# EAGLE design micro_mirror1 (EAGLE 8.6.3)
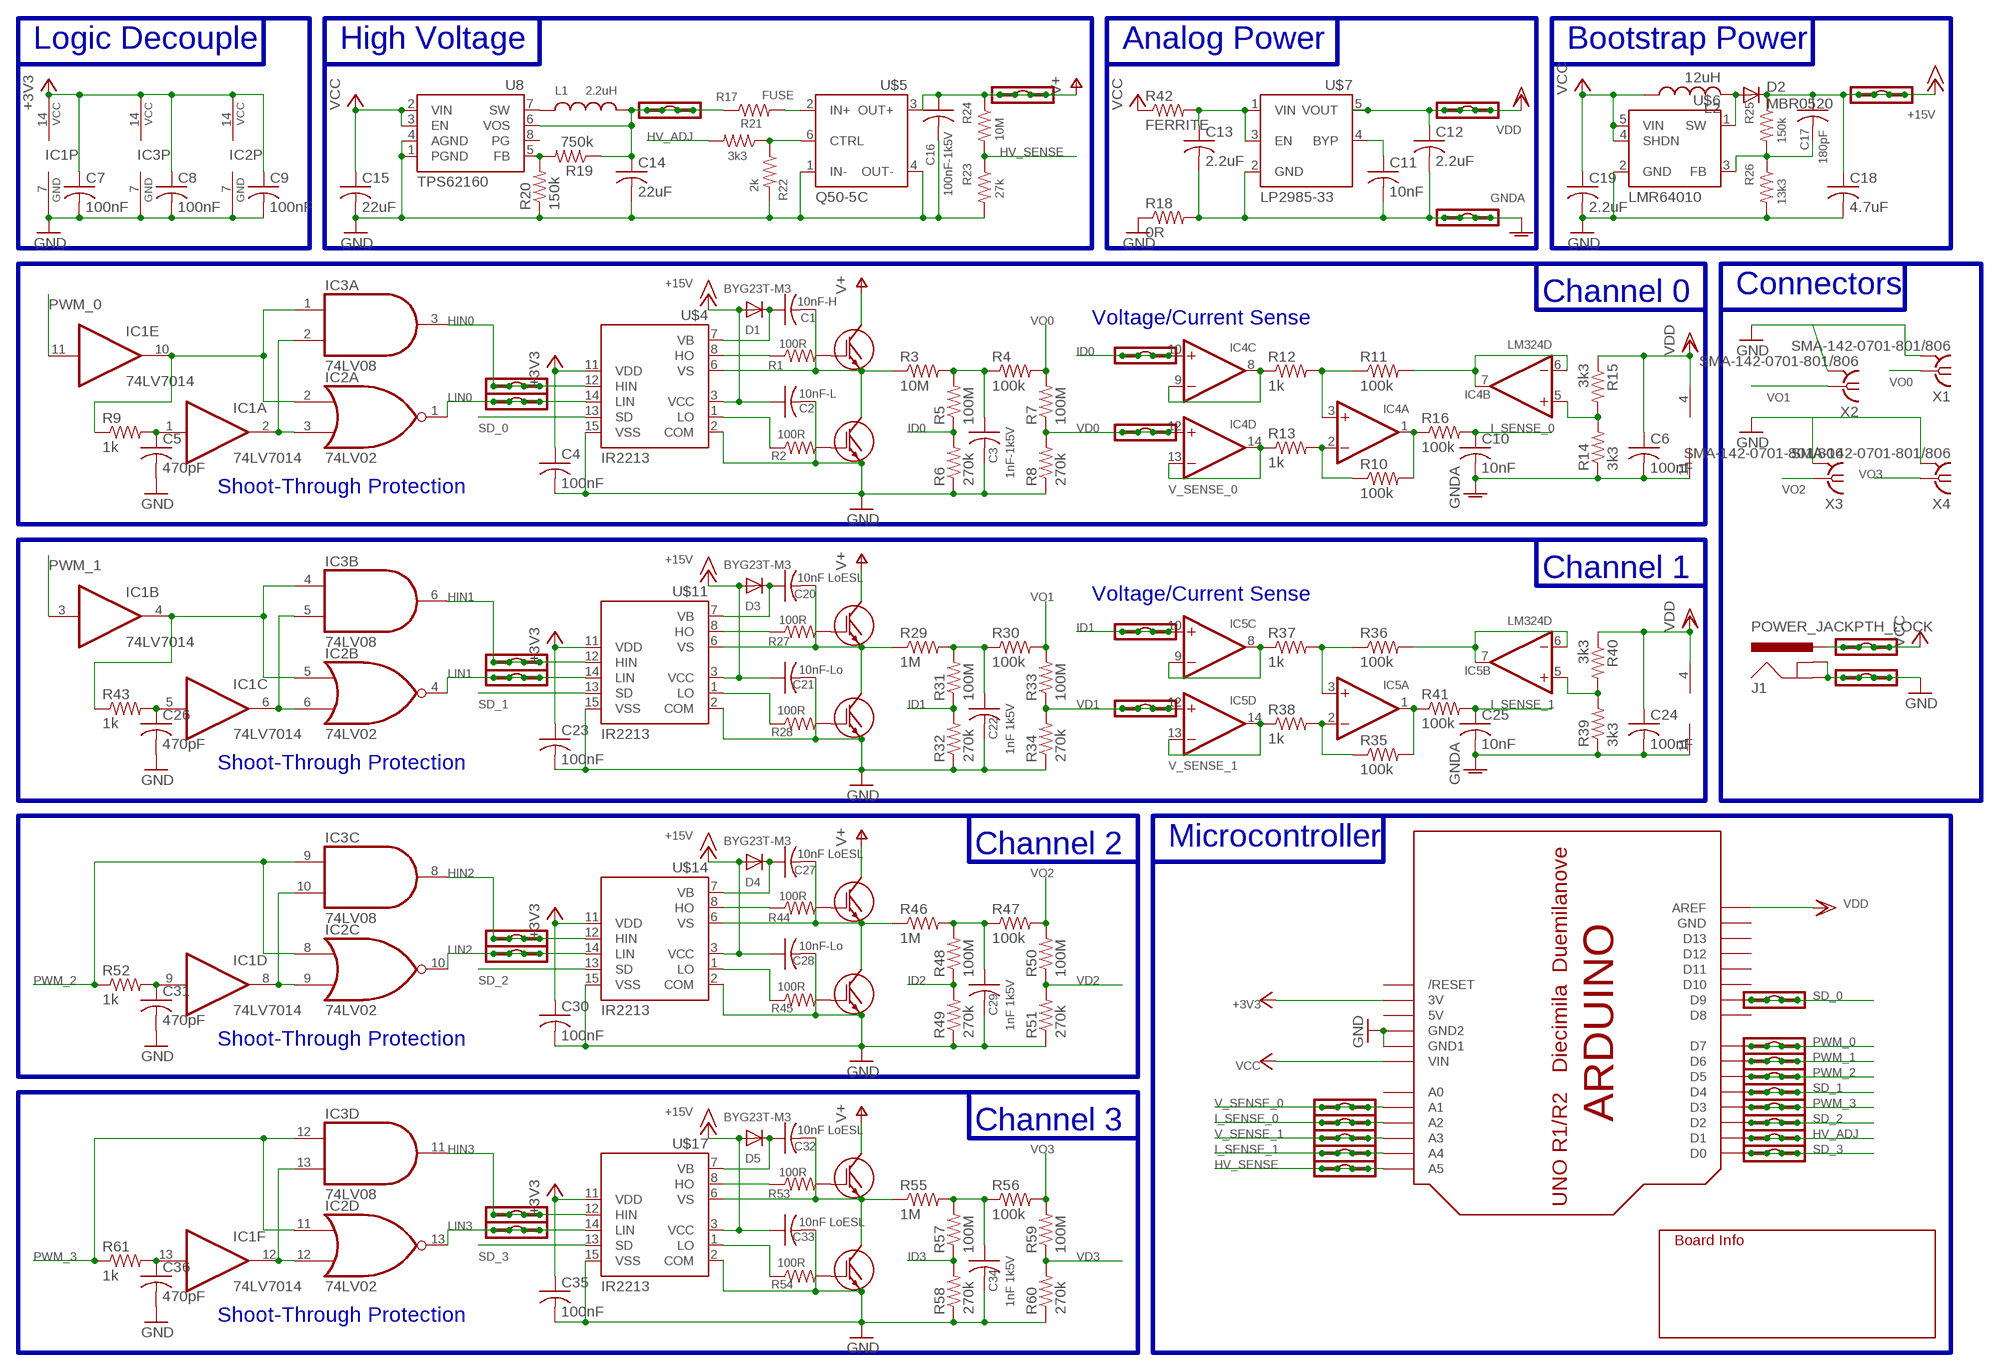
[diagram p0: schematic, sheet 1]

## Parts
15V_OUT  M04LOCK  [1X04_LOCK]
C1  10nF-H  C-USC1206  [C1206]
C2  10nF-L  C-USC1206  [C1206]
C3  1nF-1k5V  C-USC1206  [C1206]
C4  100nF  C-USC1206  [C1206]
C5  470pF  C-USC1206  [C1206]
C6  100nF  C-USC1206  [C1206]
C7  100nF  C-USC1206  [C1206]
C8  100nF  C-USC1206  [C1206]
C9  100nF  C-USC1206  [C1206]
C10  10nF  C-USC1206  [C1206]
C11  10nF  C-USC1206  [C1206]
C12  2.2uF  C-USC1206  [C1206]
C13  2.2uF  C-USC1206  [C1206]
C14  22uF  C-USC1206  [C1206]
C15  22uF  C-USC1206  [C1206]
C16  100nF-1k5V  C-USC2225K  [C2225K]
C17  180pF  C-USC1206  [C1206]
C18  4.7uF  C-USC1206  [C1206]
C19  2.2uF  C-USC1206  [C1206]
C20  10nF LoESL  C-USC1206  [C1206]
C21  10nF-Lo  C-USC1206  [C1206]
C22  1nF 1k5V  C-USC1206  [C1206]
C23  100nF  C-USC1206  [C1206]
C24  100nF  C-USC1206  [C1206]
C25  10nF  C-USC1206  [C1206]
C26  470pF  C-USC1206  [C1206]
C27  10nF LoESL  C-USC1206  [C1206]
C28  10nF-Lo  C-USC1206  [C1206]
C29  1nF 1k5V  C-USC1206  [C1206]
C30  100nF  C-USC1206  [C1206]
C31  470pF  C-USC1206  [C1206]
C32  10nF LoESL  C-USC1206  [C1206]
C33  10nF LoESL  C-USC1206  [C1206]
C34  1nF 1k5V  C-USC1206  [C1206]
C35  100nF  C-USC1206  [C1206]
C36  470pF  C-USC1206  [C1206]
D1  BYG23T-M3  DIODE-DO214AC  [DO214AC]
D2  MBR0520  DIODE-SOD123  [SOD123]
D3  BYG23T-M3  DIODE-DO214AC  [DO214AC]
D4  BYG23T-M3  DIODE-DO214AC  [DO214AC]
D5  BYG23T-M3  DIODE-DO214AC  [DO214AC]
GND  M04LOCK  [1X04_LOCK]
GNDA  M04LOCK  [1X04_LOCK]
HIN0  M04LOCK  [1X04_LOCK]
HIN1  M04LOCK  [1X04_LOCK]
HIN2  M04LOCK  [1X04_LOCK]
HIN3  M04LOCK  [1X04_LOCK]
HV_ADJ  M04LOCK  [1X04_LOCK]
HV_IN  M04LOCK  [1X04_LOCK]
HV_OUT  M04LOCK  [1X04_LOCK]
HV_SENSE  M04LOCK  [1X04_LOCK]
I_SENSE_0  M04LOCK  [1X04_LOCK]
I_SENSE_1  M04LOCK  [1X04_LOCK]
IC1  74LV7014  7407D  [SO14]
IC2  74LV02  7402D  [SO14]
IC3  74LV08  74S08D  [SO14]
IC4  LM324D  [SO14]
IC5  LM324D  [SO14]
ID0  M04LOCK  [1X04_LOCK]
ID1  M04LOCK  [1X04_LOCK]
J1  POWER_JACKPTH_LOCK  [POWER_JACK_PTH_LOCK]
L1  2.2uH  INDUCTOR  [SRN6045]
L2  12uH  L-USL1812  [L1812]
LIN0  M04LOCK  [1X04_LOCK]
LIN1  M04LOCK  [1X04_LOCK]
LIN2  M04LOCK  [1X04_LOCK]
LIN3  M04LOCK  [1X04_LOCK]
PWM_0  M04LOCK  [1X04_LOCK]
PWM_1  M04LOCK  [1X04_LOCK]
PWM_2  M04LOCK  [1X04_LOCK]
PWM_3  M04LOCK  [1X04_LOCK]
R1  100R  R-US_R1206  [R1206]
R2  100R  R-US_R1206  [R1206]
R3  10M  R-US_R1206  [R1206]
R4  100k  R-US_R1206  [R1206]
R5  100M  R-US_R1206  [R1206]
R6  270k  R-US_R1206  [R1206]
R7  100M  R-US_R1206  [R1206]
R8  270k  R-US_R1206  [R1206]
R9  1k  R-US_R1206  [R1206]
R10  100k  R-US_R1206  [R1206]
R11  100k  R-US_R1206  [R1206]
R12  1k  R-US_R1206  [R1206]
R13  1k  R-US_R1206  [R1206]
R14  3k3  R-US_R1206  [R1206]
R15  3k3  R-US_R1206  [R1206]
R16  100k  R-US_R1206  [R1206]
R17  FUSE  R-US_R1206  [R1206]
R18  0R  R-US_R1206  [R1206]
R19  750k  R-US_R1206  [R1206]
R20  150k  R-US_R1206  [R1206]
R21  3k3  R-US_R1206  [R1206]
R22  2k  R-US_R1206  [R1206]
R23  27k  R-US_R1206  [R1206]
R24  10M  R-US_R1206  [R1206]
R25  150k  R-US_R1206  [R1206]
R26  13k3  R-US_R1206  [R1206]
R27  100R  R-US_R1206  [R1206]
R28  100R  R-US_R1206  [R1206]
R29  1M  R-US_R1206  [R1206]
R30  100k  R-US_R1206  [R1206]
R31  100M  R-US_R1206  [R1206]
R32  270k  R-US_R1206  [R1206]
R33  100M  R-US_R1206  [R1206]
R34  270k  R-US_R1206  [R1206]
R35  100k  R-US_R1206  [R1206]
R36  100k  R-US_R1206  [R1206]
R37  1k  R-US_R1206  [R1206]
R38  1k  R-US_R1206  [R1206]
R39  3k3  R-US_R1206  [R1206]
R40  3k3  R-US_R1206  [R1206]
R41  100k  R-US_R1206  [R1206]
R42  FERRITE  R-US_R1206  [R1206]
R43  1k  R-US_R1206  [R1206]
R44  100R  R-US_R1206  [R1206]
R45  100R  R-US_R1206  [R1206]
R46  1M  R-US_R1206  [R1206]
R47  100k  R-US_R1206  [R1206]
R48  100M  R-US_R1206  [R1206]
R49  270k  R-US_R1206  [R1206]
R50  100M  R-US_R1206  [R1206]
R51  270k  R-US_R1206  [R1206]
R52  1k  R-US_R1206  [R1206]
R53  100R  R-US_R1206  [R1206]
R54  100R  R-US_R1206  [R1206]
R55  1M  R-US_R1206  [R1206]
R56  100k  R-US_R1206  [R1206]
R57  100M  R-US_R1206  [R1206]
R58  270k  R-US_R1206  [R1206]
R59  100M  R-US_R1206  [R1206]
R60  270k  R-US_R1206  [R1206]
R61  1k  R-US_R1206  [R1206]
SD_0  M04LOCK  [1X04_LOCK]
SD_1  M04LOCK  [1X04_LOCK]
SD_2  M04LOCK  [1X04_LOCK]
SD_3  M04LOCK  [1X04_LOCK]
U8  TPS62160  [TSSOP8]
U$1  ARDUINO-NOHOLE  [ARDUINO-NOHOLE]
U$2  HGTD1N120BNS  [TO252]
U$3  HGTD1N120BNS  [TO252]
U$4  IR2213  [SO16L]
U$5  Q50-5C  [Q50-5C]
U$6  LMR64010  [SOT23-5]
U$7  LP2985-33  [SOT23-5]
U$9  HGTD1N120BNS  [TO252]
U$10  HGTD1N120BNS  [TO252]
U$11  IR2213  [SO16L]
U$12  HGTD1N120BNS  [TO252]
U$13  HGTD1N120BNS  [TO252]
U$14  IR2213  [SO16L]
U$15  HGTD1N120BNS  [TO252]
U$16  HGTD1N120BNS  [TO252]
U$17  IR2213  [SO16L]
U$18  INFO  [INFO]
V_SENSE_0  M04LOCK  [1X04_LOCK]
V_SENSE_1  M04LOCK  [1X04_LOCK]
VCC  M04LOCK  [1X04_LOCK]
VD0  M04LOCK  [1X04_LOCK]
VD1  M04LOCK  [1X04_LOCK]
VDDA  M04LOCK  [1X04_LOCK]
X1  SMA-142-0701-801/806  [J502-ND-142-0701-801/806]
X2  SMA-142-0701-801/806  [J502-ND-142-0701-801/806]
X3  SMA-142-0701-801/806  [J502-ND-142-0701-801/806]
X4  SMA-142-0701-801/806  [J502-ND-142-0701-801/806]

## Nets
+3V3: C4.1 C7.1 C8.1 C9.1 C23.1 C30.1 C35.1 IC1.14(P:VCC) IC2.14(P:VCC) IC3.14(P:VCC) U$1.3V U$4.11(VDD) U$11.11(VDD) U$14.11(VDD) U$17.11(VDD)
+15V: 15V_OUT.1 15V_OUT.2 15V_OUT.3 15V_OUT.4 C2.1 C17.1 C18.1 C21.1 C28.1 C33.1 D1.A D2.C D3.A D4.A D5.A R25.1 U$4.3(VCC) U$11.3(VCC) U$14.3(VCC) U$17.3(VCC)
GND: C2.2 C3.2 C4.2 C5.2 C7.2 C8.2 C9.2 C14.2 C15.2 C16.2 C18.2 C19.2 C21.2 C22.2 C23.2 C26.2 C28.2 C29.2 C30.2 C31.2 C33.2 C34.2 C35.2 C36.2 GND.1 GND.2 GND.3 GND.4 IC1.7(P:GND) IC2.7(P:GND) IC3.7(P:GND) J1.GND J1.GNDBREAK R6.1 R8.1 R18.1 R20.1 R22.2 R23.2 R26.2 R32.1 R34.1 R49.1 R51.1 R58.1 R60.1 U8.1(PGND) U8.4(AGND) U$1.GND1 U$1.GND2 U$3.2(E) U$4.2(COM) U$4.15(VSS) U$5.1(IN-) U$5.4(OUT-) U$6.2(GND) U$10.2(E) U$11.2(COM) U$11.15(VSS) U$13.2(E) U$14.2(COM) U$14.15(VSS) U$16.2(E) U$17.2(COM) U$17.15(VSS) X1.G@1 X1.G@2 X1.G@3 X1.G@4 X2.G@1 X2.G@2 X2.G@3 X2.G@4 X3.G@1 X3.G@2 X3.G@3 X3.G@4 X4.G@1 X4.G@2 X4.G@3 X4.G@4
GNDA: C6.2 C10.2 C11.2 C12.2 C13.2 C24.2 C25.2 GNDA.1 GNDA.2 GNDA.3 GNDA.4 IC4.11(P:V-) IC5.11(P:V-) R14.1 R18.2 R39.1 U$7.2(GND)
HIN0: HIN0.1 HIN0.2 HIN0.3 HIN0.4 IC3.3(A:O) U$4.12(HIN)
HIN1: HIN1.1 HIN1.2 HIN1.3 HIN1.4 IC3.6(B:O) U$11.12(HIN)
HIN2: HIN2.1 HIN2.2 HIN2.3 HIN2.4 IC3.8(C:O) U$14.12(HIN)
HIN3: HIN3.1 HIN3.2 HIN3.3 HIN3.4 IC3.11(D:O) U$17.12(HIN)
HV_ADJ: HV_ADJ.1 HV_ADJ.2 HV_ADJ.3 HV_ADJ.4 R21.2 U$1.D1
HV_SENSE: HV_SENSE.1 HV_SENSE.2 HV_SENSE.3 HV_SENSE.4 R23.1 R24.2 U$1.A5
I_SENSE_0: C10.1 I_SENSE_0.1 I_SENSE_0.2 I_SENSE_0.3 I_SENSE_0.4 R16.2 U$1.A2
I_SENSE_1: C25.1 I_SENSE_1.1 I_SENSE_1.2 I_SENSE_1.3 I_SENSE_1.4 R41.2 U$1.A4
ID0: IC4.10(C:+IN) ID0.1 ID0.2 ID0.3 ID0.4 R5.1 R6.2
ID1: IC5.10(C:+IN) ID1.1 ID1.2 ID1.3 ID1.4 R31.1 R32.2
ID2: R48.1 R49.2
ID3: R57.1 R58.2
LIN0: IC2.1(A:O) LIN0.1 LIN0.2 LIN0.3 LIN0.4 U$4.14(LIN)
LIN1: IC2.4(B:O) LIN1.1 LIN1.2 LIN1.3 LIN1.4 U$11.14(LIN)
LIN2: IC2.10(C:O) LIN2.1 LIN2.2 LIN2.3 LIN2.4 U$14.14(LIN)
LIN3: IC2.13(D:O) LIN3.1 LIN3.2 LIN3.3 LIN3.4 U$17.14(LIN)
N$1: R1.2 U$2.1(G)
N$2: R2.2 U$3.1(G)
N$3: C1.2 R3.1 U$2.2(E) U$3.3(C) U$4.6(VS)
N$4: C3.1 R3.2 R4.1 R5.2
N$5: C1.1 D1.C U$4.7(VB)
N$6: R1.1 U$4.8(HO)
N$7: R2.1 U$4.1(LO)
N$8: IC1.2(A:O) IC2.3(A:I1) IC3.2(A:I1)
N$9: IC4.8(C:OUT) IC4.9(C:-IN) R12.1
N$10: C5.1 IC1.1(A:I) R9.2
N$11: IC4.1(A:OUT) R10.2 R16.1
N$12: R17.2 U$5.2(IN+)
N$13: IC4.2(A:-IN) R10.1 R13.2
N$14: IC4.3(A:+IN) R11.1 R12.2
N$15: IC4.5(B:+IN) R14.2 R15.2
N$16: IC4.6(B:-IN) IC4.7(B:OUT) R11.2
N$17: L1.1 U8.7(SW)
N$18: C14.1 HV_IN.1 HV_IN.2 HV_IN.3 HV_IN.4 L1.2 R17.1 R19.1 U8.6(VOS)
N$19: C11.1 U$7.4(BYP)
N$20: R19.2 R20.2 U8.5(FB)
N$21: D2.A L2.2 U$6.1(SW)
N$22: R27.2 U$9.1(G)
N$23: C17.2 R25.2 R26.1 U$6.3(FB)
N$24: R21.1 R22.1 U$5.6(CTRL)
N$25: R28.2 U$10.1(G)
N$26: C20.2 R29.1 U$9.2(E) U$10.3(C) U$11.6(VS)
N$27: R27.1 U$11.8(HO)
N$28: R28.1 U$11.1(LO)
N$29: C20.1 D3.C U$11.7(VB)
N$30: C22.1 R29.2 R30.1 R31.2
N$31: IC5.8(C:OUT) IC5.9(C:-IN) R37.1
N$32: IC5.2(A:-IN) R35.1 R38.2
N$33: IC5.3(A:+IN) R36.1 R37.2
N$34: IC5.6(B:-IN) IC5.7(B:OUT) R36.2
N$35: IC5.1(A:OUT) R35.2 R41.1
N$36: IC5.5(B:+IN) R39.2 R40.2
N$37: C13.1 R42.2 U$7.1(VIN) U$7.3(EN)
N$38: IC1.6(C:O) IC2.6(B:I1) IC3.5(B:I1)
N$39: C26.1 IC1.5(C:I) R43.2
N$40: R44.2 U$12.1(G)
N$41: R45.2 U$13.1(G)
N$42: C27.2 R46.1 U$12.2(E) U$13.3(C) U$14.6(VS)
N$43: R44.1 U$14.8(HO)
N$44: R45.1 U$14.1(LO)
N$45: C27.1 D4.C U$14.7(VB)
N$46: C29.1 R46.2 R47.1 R48.2
N$47: IC1.8(D:O) IC2.9(C:I1) IC3.10(C:I1)
N$48: R53.2 U$15.1(G)
N$49: C31.1 IC1.9(D:I) R52.2
N$50: R54.2 U$16.1(G)
N$51: C32.2 R55.1 U$15.2(E) U$16.3(C) U$17.6(VS)
N$52: R53.1 U$17.8(HO)
N$53: R54.1 U$17.1(LO)
N$54: C32.1 D5.C U$17.7(VB)
N$55: C34.1 R55.2 R56.1 R57.2
N$56: IC1.12(F:O) IC2.12(D:I1) IC3.13(D:I1)
N$57: C36.1 IC1.13(F:I) R61.2
N$58: IC1.4(B:O) IC2.5(B:I0) IC3.4(B:I0) R43.1
N$59: IC1.10(E:O) IC2.2(A:I0) IC3.1(A:I0) R9.1
PWM_0: IC1.11(E:I) PWM_0.1 PWM_0.2 PWM_0.3 PWM_0.4 U$1.D7
PWM_1: IC1.3(B:I) PWM_1.1 PWM_1.2 PWM_1.3 PWM_1.4 U$1.D6
PWM_2: IC2.8(C:I0) IC3.9(C:I0) PWM_2.1 PWM_2.2 PWM_2.3 PWM_2.4 R52.1 U$1.D5
PWM_3: IC2.11(D:I0) IC3.12(D:I0) PWM_3.1 PWM_3.2 PWM_3.3 PWM_3.4 R61.1 U$1.D3
SD_0: SD_0.1 SD_0.2 SD_0.3 SD_0.4 U$1.D9 U$4.13(SD)
SD_1: SD_1.1 SD_1.2 SD_1.3 SD_1.4 U$1.D4 U$11.13(SD)
SD_2: SD_2.1 SD_2.2 SD_2.3 SD_2.4 U$1.D2 U$14.13(SD)
SD_3: SD_3.1 SD_3.2 SD_3.3 SD_3.4 U$1.D0 U$17.13(SD)
V+: C16.1 HV_OUT.1 HV_OUT.2 HV_OUT.3 HV_OUT.4 R24.1 U$2.3(C) U$5.3(OUT+) U$9.3(C) U$12.3(C) U$15.3(C)
V_SENSE_0: IC4.13(D:-IN) IC4.14(D:OUT) R13.1 U$1.A1 V_SENSE_0.1 V_SENSE_0.2 V_SENSE_0.3 V_SENSE_0.4
V_SENSE_1: IC5.13(D:-IN) IC5.14(D:OUT) R38.1 U$1.A3 V_SENSE_1.1 V_SENSE_1.2 V_SENSE_1.3 V_SENSE_1.4
VCC: C15.1 C19.1 J1.PWR L2.1 R42.1 U8.2(VIN) U8.3(EN) U$1.VIN U$6.4(SHDN) U$6.5(VIN) VCC.1 VCC.2 VCC.3 VCC.4
VD0: IC4.12(D:+IN) R7.1 R8.2 VD0.1 VD0.2 VD0.3 VD0.4
VD1: IC5.12(D:+IN) R33.1 R34.2 VD1.1 VD1.2 VD1.3 VD1.4
VD2: R50.1 R51.2
VD3: R59.1 R60.2
VDD: C6.1 C12.1 C24.1 IC4.4(P:V+) IC5.4(P:V+) R15.1 R40.1 U$1.AREF U$7.5(VOUT) VDDA.1 VDDA.2 VDDA.3 VDDA.4
VO0: R4.2 R7.2 X1.1
VO1: R30.2 R33.2 X2.1
VO2: R47.2 R50.2 X3.1
VO3: R56.2 R59.2 X4.1
Unconnected: U8.8(PG) U$1.A0 U$1.D8 U$1.D10 U$1.D11 U$1.D12 U$1.D13 U$1.RESET(/RESET)

## Buses
B$1
B$2
B$3
B$4
B$5
B$6
B$7
B$8

## Notes on the sheet
- Logic Decouple | High Voltage | Analog Power | Bootstrap Power
- Channel 0
- Connectors
- Voltage/Current Sense
- Shoot-Through Protection
- Channel 1
- Voltage/Current Sense
- Shoot-Through Protection
- Channel 2
- Microcontroller
- Shoot-Through Protection
- Channel 3
- Shoot-Through Protection

## Power pins joined to a net without a drawn wire
5V: U$1.5V
GND: U$1.GND

## Library data of the parts
15V_OUT GND GNDA HIN0 HIN1-HIN3 HV_ADJ HV_IN HV_OUT HV_SENSE I_SENSE_0 I_SENSE_1 ID0 ID1 LIN0 LIN1-LIN3 PWM_0 PWM_1-PWM_3 SD_0 SD_1-SD_3 V_SENSE_0 V_SENSE_1 VCC VD0 VD1 VDDA = modular_robotics:M04: Header 4 Standard 4-pin 0.1" header. Use with straight break away headers (SKU : PRT-00116), right angle break away headers (PRT-00553), swiss pins (PRT-00743), machine pins (PRT-00117), and female headers (PRT-00115). Molex polarized connector foot print use with SKU : PRT-08231 with associated crimp pins and housings. 1MM SMD Version SKU: PRT-10208
C1-C36 = rcl:C-US: CAPACITOR, American symbol
D1-D5 = diode:DIODE-: DIODE
IC1 = 74xx-us:74*07: Hex BUFFER, open collector high-voltage output
IC2 = 74xx-us:74*02: Quad 2-input NOR gate
IC3 = 74xx-us:74*08: Quad 2-input AND gate
IC4 IC5 = linear:LM324: OP AMP
J1 = SparkFun-Connectors:POWER_JACK: Power Jack This is the standard 5.5mm barrel jack for power. The PTH is the most common, proven, reliable, footprint. The Slot footprint only works if the mill layer is transmitted to the PCB fab house so be warned. Mating wall wart : TOL-00298 (and others); PROD_ID: PRT-00119
L1 = modular_robotics:INDUCTOR
L2 = rcl:L-US: INDUCTOR, American symbol
R1-R61 = rcl:R-US_: RESISTOR, American symbol
U8 = modular_robotics:TPS62160
U$1 = adafruit:ARDUINO: Arduino Diecimila/Duemilanove Make a shield with ease, this package has all the named pins as well as the two mounting drill holes and an outline of the USB and DC power connector. The outline is on the DIMENSION layer, so if your board house uses it they will cut the outline to match. http://www.ladyada.net/library/pcb/eaglelibrary.html
U$2 U$3 U$9 U$10 U$12 U$13 U$15 U$16 = modular_robotics:HGTD1N120BNS
U$4 U$11 U$14 U$17 = modular_robotics:IR2213
U$5 = modular_robotics:Q50-5C
U$6 = modular_robotics:LMR64010
U$7 = modular_robotics:LP2985-33
U$18 = modular_robotics:INFO; AUTHOR: A. Buchan; DATE: Oct. 13, 2016; DESIGN: Micro Mirror Drive; ORGANIZATION: Biomimetic Millisystems Lab; REVISION: r0.0
X1-X4 = con-coax:SMA-: SMA 50 Ohm End Launch Jack Receptacle - Round Contact Johnson Components Source: www.johnsoncomponents.com .. J502-ND.pdf; MF: JOHNSON COMPONENTS; MPN: 142-0701-801; OC_FARNELL: 1608592; OC_NEWARK: 90F2624

## Board
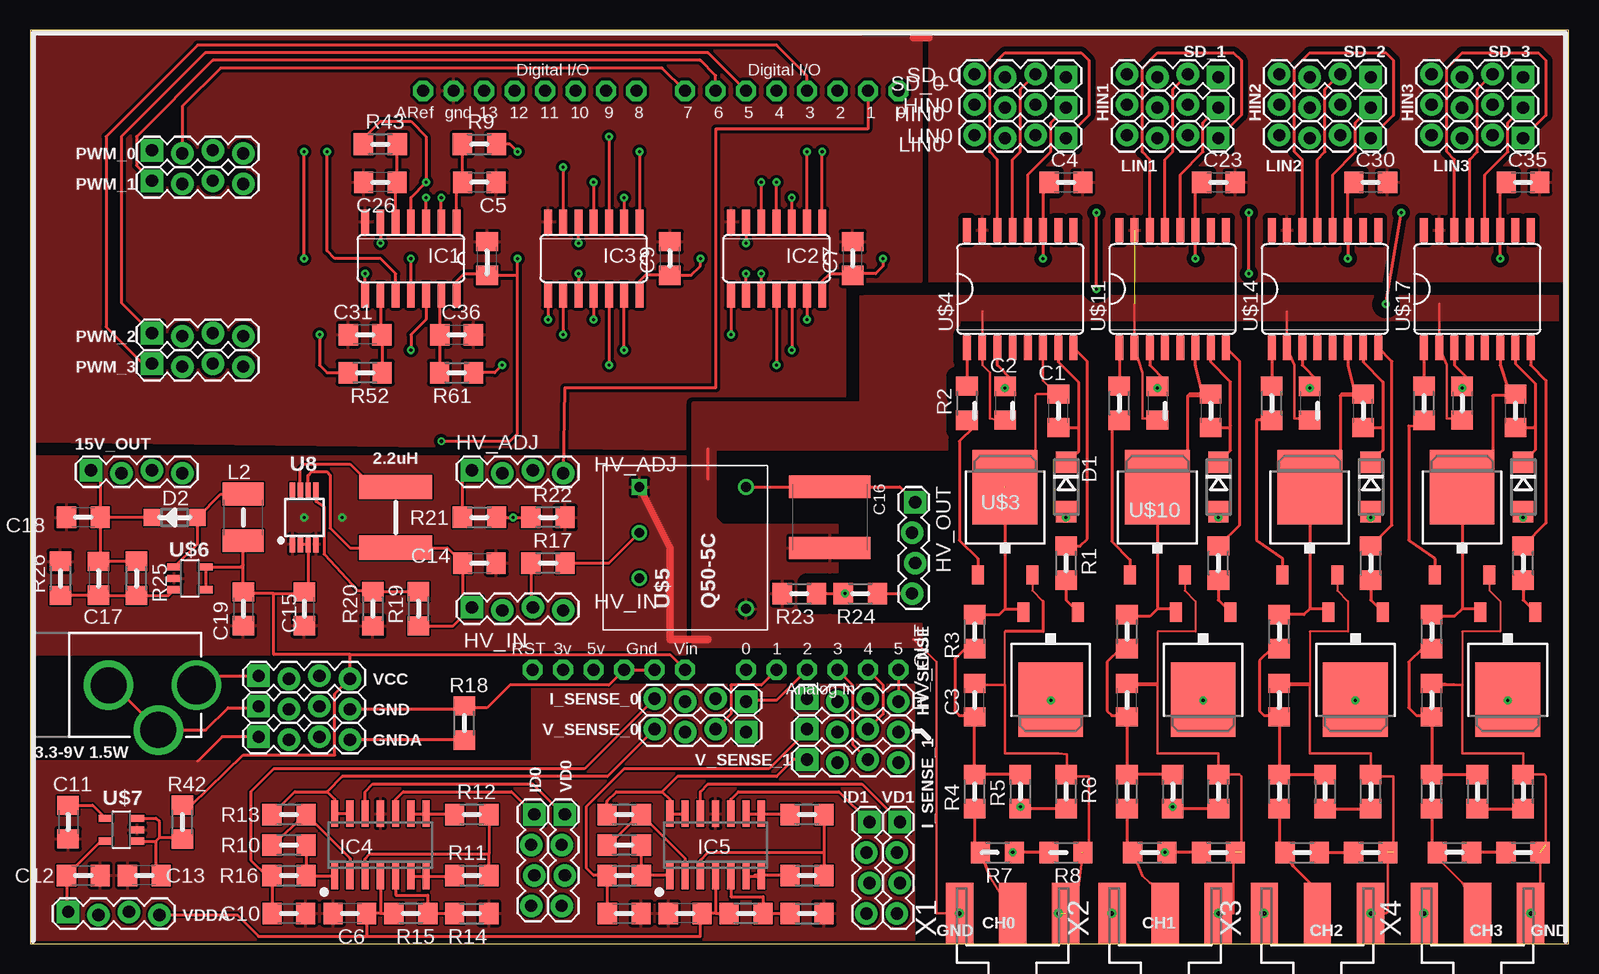
[diagram p1: board, top side]
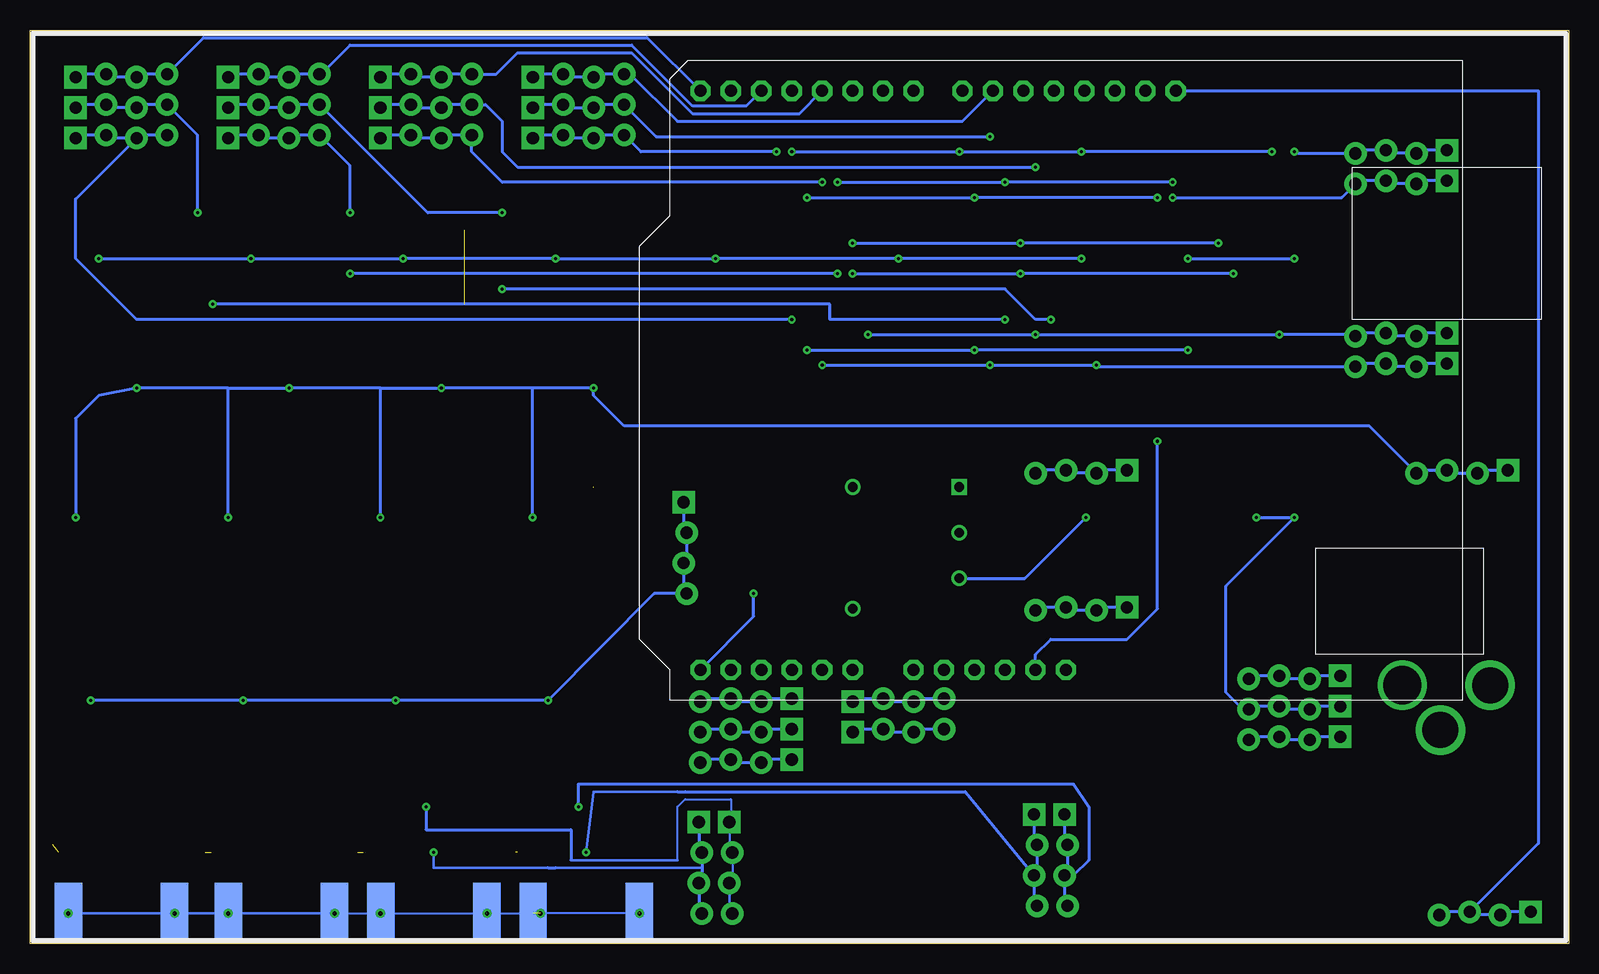
[diagram p2: board, bottom side, seen from below]

Size 128.27 x 76.2 mm. Coordinates in mm from the lower left corner, seen from the top.
Outline: 0,0 128.27,0 128.27,76.2 0,76.2 0,0
Copper layers (1*16): Top 0.035mm / dielectric 1.5mm / Bottom 0.035mm
Design rules "default *": minimum track width 6mil, minimum drill 10mil, track to track 6mil, track to pad 6mil, pad to pad 6mil, via to via 6mil, smd to smd 6mil, copper to edge 10mil, drill to drill 8mil, minimum pad ring 10mil, minimum via ring 8mil, stop-mask expansion 4mil, vias tented up to drill 0mil, thermal gap 10mil

### Footprints (pad centres in the part's own frame; a part is rotated, then mirrored left to right if it is on the bottom)
1X04_LOCK = drill 1.016 pad 1.88 square: 1 0,0.127 | drill 1.016 pad 1.88: 2 2.54,-0.127; 3 5.08,0.127; 4 7.62,-0.127
C1206 = smd 1.6 x 1.8: 1 -1.4,0; 2 1.4,0
C2225K = smd 1.85 x 6.8: 1 -2.55,0; 2 2.55,0
DO214AC = smd 1.8 x 1.7: A 2.05,0; C -2.05,0
SOD123 = smd 1.4 x 1.4: A 1.9,0; C -1.9,0
SO14 = smd 0.66 x 2.032: 1 -3.81,-3.073; 2 -2.54,-3.073; 3 -1.27,-3.073; 4 0,-3.073; 5 1.27,-3.073; 6 2.54,-3.073; 7 3.81,-3.073; 8 3.81,3.073; 9 2.54,3.073; 10 1.27,3.073; 11 0,3.073; 12 -1.27,3.073; 13 -2.54,3.073; 14 -3.81,3.073
SO14' = smd 0.6 x 2.2: 1 -3.81,-2.6; 2 -2.54,-2.6; 3 -1.27,-2.6; 4 0,-2.6; 5 1.27,-2.6; 6 2.54,-2.6; 7 3.81,-2.6; 8 3.81,2.6; 9 2.54,2.6; 10 1.27,2.6; 11 0,2.6; 12 -1.27,2.6; 13 -2.54,2.6; 14 -3.81,2.6
POWER_JACK_PTH_LOCK = drill 2.997 pad 4.115: GND 0.025,6.557; GNDBREAK 3.762,10.7 | drill 3.2 pad 4.115: PWR 0,13.878
SRN6045 = smd 2.032 x 6.096: 1 -2.54,0; 2 2.54,0
L1812 = smd 1.9 x 3.4: 1 -1.95,0; 2 1.95,0
R1206 = smd 1.6 x 1.803: 1 -1.422,0; 2 1.422,0
TSSOP8 = smd 0.45 x 1.45: 1 -0.975,-2.2; 2 -0.325,-2.2; 3 0.325,-2.2; 4 0.975,-2.2; 5 0.975,2.2; 6 0.325,2.2; 7 -0.325,2.2; 8 -0.975,2.2
ARDUINO-NOHOLE = drill 1 pad 1.676 octagon: 3V 35.56,2.54; 5V 38.1,2.54; A0 50.8,2.54; A1 53.34,2.54; A2 55.88,2.54; A3 58.42,2.54; A4 60.96,2.54; A5 63.5,2.54; AREF 23.876,50.8; D0 63.5,50.8; D1 60.96,50.8; D2 58.42,50.8; D3 55.88,50.8; D4 53.34,50.8; D5 50.8,50.8; D6 48.26,50.8; D7 45.72,50.8; D8 41.656,50.8; D9 39.116,50.8; D10 36.576,50.8; D11 34.036,50.8; D12 31.496,50.8; D13 28.956,50.8; GND 26.416,50.8; GND1 43.18,2.54; GND2 40.64,2.54; RESET 33.02,2.54; VIN 45.72,2.54
TO252 = smd 1 x 1.6: 1 -2.28,-4.8; 2 2.28,-4.8 | smd 5.4 x 6.2: 3 0,2.5
SO16L = smd 0.66 x 2.032: 1 -4.445,-4.902; 2 -3.175,-4.902; 3 -1.905,-4.902; 4 -0.635,-4.902; 5 0.635,-4.902; 6 1.905,-4.902; 7 3.175,-4.902; 8 4.445,-4.902; 9 4.445,4.902; 10 3.175,4.902; 11 1.905,4.902; 12 0.635,4.902; 13 -0.635,4.902; 14 -1.905,4.902; 15 -3.175,4.902; 16 -4.445,4.902
Q50-5C = drill 0.8 square: 1 0,0 | drill 0.8: 2 0,-3.81; 3 8.89,0; 4 8.89,-10.16; 6 0,-7.62
SOT23-5 = smd 0.6 x 1.2: 1 -0.95,-1.306; 2 0,-1.306; 3 0.95,-1.306; 4 0.95,1.306; 5 -0.95,1.306
J502-ND-142-0701-801/806 = smd 5.08 x 2.286: 1 2.565,0; G@1 2.565,4.42; G@2 2.565,-4.42 | smd 5.08 x 2.286 bottom: G@3 2.565,4.42; G@4 2.565,-4.42

### Placement (x,y rotation side)
15V_OUT  5.08,39.37 0 top
C1  85.72,44.45 90 top
C2  81.28,45.09 270 top
C3  78.74,20.32 90 top
C4  86.36,63.5 0 top
C5  37.47,63.5 0 top
C6  26.67,2.54 180 top
C7  68.58,57.15 90 top
C8  38.1,57.15 90 top
C9  53.34,57.15 90 top
C10  21.59,2.54 0 top
C11  3.17,10.16 270 top
C12  4.45,5.71 0 top
C13  9.53,5.71 180 top
C14  37.47,31.75 0 top
C15  22.86,27.94 270 top
C16  66.67,35.56 270 top
C17  5.71,30.48 270 top
C18  4.45,35.56 180 top
C19  17.78,27.94 270 top
C20  98.42,44.45 90 top
C21  93.98,45.09 270 top
C22  91.44,20.32 90 top
C23  99.06,63.5 0 top
C24  54.61,2.54 180 top
C25  49.53,2.54 0 top
C26  29.21,63.5 180 top
C27  111.12,44.45 90 top
C28  106.68,45.09 270 top
C29  104.14,20.32 90 top
C30  111.76,63.5 0 top
C31  27.94,50.8 180 top
C32  123.83,44.45 90 top
C33  119.38,45.09 270 top
C34  116.84,20.32 90 top
C35  124.46,63.5 0 top
C36  35.56,50.8 0 top
D1  86.36,38.1 270 top
D2  12.06,35.56 0 top
D3  99.06,38.1 270 top
D4  111.76,38.1 270 top
D5  124.46,38.1 270 top
GND  19.05,19.68 0 top
GNDA  19.05,17.14 0 top
HIN0  86.36,69.85 180 top
HIN1  99.06,69.85 180 top
HIN2  111.76,69.85 180 top
HIN3  124.46,69.85 180 top
HV_ADJ  36.83,39.37 0 top
HV_IN  36.83,27.94 0 top
HV_OUT  73.66,36.83 270 top
HV_SENSE  64.77,20.32 0 top
I_SENSE_0  59.69,20.32 180 top
I_SENSE_1  64.77,17.78 0 top
IC1  31.75,57.15 180 top
IC2  62.23,57.15 180 top
IC3  46.99,57.15 180 top
IC4  LM324D  [SO14']  29.21,8.26 0 top
IC5  LM324D  [SO14']  57.15,8.26 0 top
ID0  41.91,10.79 270 top
ID1  69.85,10.16 270 top
J1  0,21.59 270 top
L1  30.48,35.56 270 top
L2  17.78,35.56 90 top
LIN0  86.36,67.31 180 top
LIN1  99.06,67.31 180 top
LIN2  111.76,67.31 180 top
LIN3  124.46,67.31 180 top
PWM_0  10.16,66.04 0 top
PWM_1  10.16,63.5 0 top
PWM_2  10.16,50.8 0 top
PWM_3  10.16,48.26 0 top
R1  86.36,31.75 270 top
R2  78.11,45.09 270 top
R3  78.74,26.04 270 top
R4  78.74,12.7 270 top
R5  82.55,12.7 90 top
R6  86.36,12.7 270 top
R7  80.64,7.62 180 top
R8  86.36,7.62 180 top
R9  37.47,66.67 180 top
R10  21.59,8.26 0 top
R11  36.83,5.71 180 top
R12  36.83,10.79 0 top
R13  21.59,10.79 0 top
R14  36.83,2.54 180 top
R15  31.75,2.54 0 top
R16  21.59,5.71 180 top
R17  43.18,31.75 0 top
R18  36.2,18.41 270 top
R19  32.38,27.94 90 top
R20  28.57,27.94 90 top
R21  37.47,35.56 180 top
R22  43.18,35.56 0 top
R23  64.14,29.21 180 top
R24  69.22,29.21 180 top
R25  8.89,30.48 270 top
R26  2.54,30.48 90 top
R27  99.06,31.75 270 top
R28  90.81,45.09 270 top
R29  91.44,26.04 270 top
R30  91.44,12.7 270 top
R31  95.25,12.7 90 top
R32  99.06,12.7 270 top
R33  93.34,7.62 180 top
R34  99.06,7.62 180 top
R35  49.53,8.26 0 top
R36  64.77,5.71 180 top
R37  64.77,10.79 0 top
R38  49.53,10.79 0 top
R39  64.77,2.54 180 top
R40  59.69,2.54 0 top
R41  49.53,5.71 180 top
R42  12.7,10.16 270 top
R43  29.21,66.67 0 top
R44  111.76,31.75 270 top
R45  103.5,45.09 270 top
R46  104.14,26.04 270 top
R47  104.14,12.7 270 top
R48  107.95,12.7 90 top
R49  111.76,12.7 270 top
R50  106.05,7.62 180 top
R51  111.76,7.62 180 top
R52  27.94,47.62 0 top
R53  124.46,31.75 270 top
R54  116.2,45.09 270 top
R55  116.84,26.04 270 top
R56  116.84,12.7 270 top
R57  120.65,12.7 90 top
R58  124.46,12.7 270 top
R59  118.75,7.62 180 top
R60  124.46,7.62 180 top
R61  35.56,47.62 180 top
SD_0  86.36,72.39 180 top
SD_1  99.06,72.39 180 top
SD_2  111.76,72.39 180 top
SD_3  124.46,72.39 180 top
U8  22.86,35.56 0 top
U$1  8.89,20.32 0 top
U$2  85.09,22.86 180 top
U$3  81.28,35.56 0 top
U$4  82.55,54.61 0 top
U$5  50.8,38.1 0 top
U$6  13.34,30.48 270 top
U$7  7.62,9.53 90 top
U$9  97.79,22.86 180 top
U$10  93.98,35.56 0 top
U$11  95.25,54.61 0 top
U$12  110.49,22.86 180 top
U$13  106.68,35.56 0 top
U$14  107.95,54.61 0 top
U$15  123.19,22.86 180 top
U$16  119.38,35.56 0 top
U$17  120.65,54.61 0 top
U$18  1.27,70.48 0 top
V_SENSE_0  59.69,17.78 180 top
V_SENSE_1  64.77,15.24 0 top
VCC  19.05,22.23 0 top
VD0  44.45,10.79 270 top
VD1  72.39,10.16 270 top
VDDA  3.17,2.54 0 top
X1  81.92,0 90 top
X2  94.61,0 90 top
X3  107.31,0 90 top
X4  120.65,0 90 top

### Tracks (layer width: path | path; a pad name or v marks a point on that pad's centre or on a via)
+3V3  (via drill 0.25)
  Top 0.254: C4.1 84.45,62.73 U$4.11 v84.45,57.15 | C23.1 97.16,62.99 U$11.11 v97.16,57.15 | v71.12,57.15 71.12,56.52 70.48,55.88 68.71,55.88 C7.1 68.45,55.88 66.67,55.88 66.04,55.24 IC2.14 | v55.88,57.15 55.88,56.52 55.12,55.75 C9.1 51.3,55.75 50.8,55.24 IC3.14 | IC1.14 35.56,55.24 36.2,55.88 37.97,55.88 C8.1 40.51,55.75 40.64,55.88 | v34.29,41.91 40.01,41.91 40.64,42.55 40.64,55.88 | 40.64,55.88 v40.64,57.15 | v109.86,57.15 U$14.11 109.86,62.99 C30.1 | v122.56,57.15 U$17.11 122.56,62.99 C35.1
  Bottom 0.254: v40.64,57.15 v55.88,57.15 v71.12,57.15 v84.45,57.15 v97.16,57.15 v109.86,57.15 v122.56,57.15 | U$1.3V 44.45,24.13 43.18,25.4 36.83,25.4 34.29,27.94 v34.29,41.91
+15V  (via drill 0.25)
  Top 0.254: U$4.3 80.64,48.26 81.92,46.99 C2.1 v81.28,46.35 | U$11.3 93.34,48.26 94.61,46.99 C21.1 v93.98,46.35 | R25.1 5.74,31.9 C17.1 5.84,32.01 C18.1 | D2.C C18.1 | 15V_OUT.1 5.84,38.73 C18.1 | D1.A v86.36,35.56 | D3.A v99.06,35.56 | U$14.3 106.05,48.26 107.31,46.99 C28.1 v106.68,46.35 | U$17.3 118.75,48.26 120.02,46.99 C33.1 v119.38,46.35 | 124.46,36.2 D5.A v124.46,35.56 | D4.A v111.76,35.56
  Bottom 0.254: 86.36,46.35 v81.28,46.35 81.28,45.72 78.74,43.18 16.64,43.18 15V_OUT.4 12.45,39.5 15V_OUT.3 9.91,39.24 15V_OUT.2 7.37,39.5 15V_OUT.1 | 86.36,46.35 v93.98,46.35 99.06,46.35 | v86.36,35.56 86.36,46.35 | v99.06,35.56 99.06,46.35 | 99.06,46.35 v106.68,46.35 111.76,46.35 | v111.76,35.56 111.76,46.35 | 111.76,46.35 v119.38,46.35 122.56,45.72 124.46,43.81 v124.46,35.56
GND  (via drill 0.25, 0.35)  (15 unrouted)
  Top 0.152: U$3.2 83.56,29.47 84.45,28.57 | 81.28,21.59 81.28,26.04 | U$10.2 96.26,29.47 97.16,28.57 97.16,26.04 93.98,26.04 93.98,21.59 | U$13.2 108.96,29.47 109.86,28.57 109.86,26.04 106.68,26.04 106.68,21.59 | U$16.2 121.66,29.47 122.56,28.57 122.56,26.04 119.38,26.04 119.38,21.59
  Top 0.203: C2.2 80.78,43.69 80.01,43.81 80.01,47.62 79.38,48.26 U$4.2 79.38,52.7 | C21.2 93.47,43.05 93.98,43.81 92.71,43.81 92.71,47.62 U$11.2 92.08,53.34 | C28.2 106.81,43.69 106.05,43.81 105.41,43.81 105.41,48.26 U$14.2 104.78,52.7 | C33.2 119.51,43.81 118.11,43.81 118.11,48.26 U$17.2 117.47,53.34 | 116.84,21.59 119.38,21.59 | C34.2 117.34,21.72 119.38,21.59 | 119.38,21.59 119.38,15.88 124.46,15.88 R58.1 126.21,14.12 126.36,13.97 126.36,8.26 | 106.68,21.59 103.5,21.59 | C29.2 106.55,21.72 106.68,21.59 | 106.68,21.59 106.68,15.88 111.76,15.88 R49.1 111.91,13.97 113.67,13.97 113.67,7.62 | 93.98,21.59 91.44,21.59 | C22.2 93.85,21.72 93.98,21.59 | 93.98,21.59 93.98,15.88 99.06,15.88 R32.1 100.81,14.12 100.97,13.97 100.97,7.62 | R60.1 125.88,2.39 v125.09,2.54 | R51.1 113.18,2.69 113.03,2.54 111.76,2.54 X3.G@2 | R34.1 100.33,7.47 100.33,2.54 99.06,2.54 X2.G@2 | R8.1 87.15,2.69 87,2.54 v85.72,2.54 | R6.1 86.44,14.05 | 86.44,14.05 86.51,13.97 88.27,13.97 88.27,8.26 87.63,7.62 | C3.2 78.87,21.59 81.28,21.59 81.28,15.88 85.72,15.88 86.44,15.8 86.44,14.05 | X1.G@1 75.59,2.56 75.56,2.54 75.56,23.5 73.66,25.4
  Top 0.254: J1.GND 6.96,21.57 J1.GNDBREAK 14.65,17.83 16.51,19.68 18.92,19.68 GND.1 | GND.4 35.92,19.56 R18.1 36.35,19.68 38.1,19.68 40.01,21.59 48.26,21.59 U$1.GND2 U$1.GND1 | 84.45,28.57 84.45,26.04 81.28,26.04 | 56.52,38.73 56.52,41.27
  Top 0.61: U$5.1 53.34,33.02 53.34,25.4 56.52,25.4 | 73.66,75.56 74.93,75.56
  Bottom 0.152: X1.G@1 X1.G@2 X2.G@1 X2.G@2 X3.G@1 v102.87,2.54 | X4.G@2 v125.09,2.54 | X3.G@2 arc90 111.75,2.55 111.76,2.55 | X3.G@2 arc90 111.75,2.55 113.03,2.55 | X3.G@2 arc90 112.34,4.45 | 112.34,4.45 112.39,0.64 112.39,2.54 | 111.76,2.54 112.34,4.45 | v77.47,2.54 76.83,2.54
  Bottom 0.203: v102.87,2.54 109.86,2.54 111.76,2.55 113.03,2.55 X4.G@1 X4.G@2
  Bottom 0.254: v26.04,35.56 v22.86,35.56 28.57,29.84 28.57,20.95 27.18,19.56 GND.4 26.42,19.81 GND.3 23.88,19.56 GND.2 21.34,19.81 GND.1
  pour Top (isolate 0.813): 55.24,41.27 76.83,41.27 77.47,52.07 127.64,52.07 127.64,53.98 69.22,53.98 69.22,45.09 55.24,45.09
  pour Top: 54.61,24.13 0,24.13 0,40.64 54.61,40.64
  pour Top (isolate 0.254): 0,41.91 54.61,41.27 54.61,45.09 arc-90 55.24,45.72 67.94,45.72 67.94,55.24 74.3,55.24 74.3,75.56 0,76.2
  pour Top (isolate 0.406): 74.93,76.2 74.93,55.24 128.27,55.24 128.27,76.2
  pour Top (isolate 0.813): 55.24,41.27 55.24,24.77 74.3,24.77 74.3,26.67 67.31,26.67 67.31,34.92 57.78,34.92 57.15,35.56 57.15,41.27
GNDA
  Top 0.254: R18.2 36.17,17.02 GNDA.4 | GNDA.1 16,17.27 13.97,15.24
  Bottom 0.254: GNDA.4 26.42,17.27 GNDA.3 23.88,17.02 GNDA.2 21.34,17.27 GNDA.1
  pour Top: 0,15.24 41.91,15.24 41.91,21.59 73.66,21.59 73.66,0 0,0
HIN0  (via drill 0.25)
  Top 0.254: v48.26,67.31 IC3.3 | U$4.12 83.19,64.14 85.09,66.04 85.09,68.45 HIN0.1
  Bottom 0.254: HIN0.1 86.11,69.98 HIN0.2 83.57,69.72 HIN0.3 81.03,69.98 HIN0.4 76.07,67.31 v48.26,67.31
HIN1  (via drill 0.25)
  Top 0.254: v44.45,64.77 IC3.6 | U$11.12 95.89,64.14 97.79,66.04 97.79,68.45 HIN1.1
  Bottom 0.254: HIN1.1 98.81,69.98 HIN1.2 96.27,69.72 HIN1.3 93.73,69.98 HIN1.4 90.3,69.98 88.9,68.58 88.9,66.04 87.63,64.77 v44.45,64.77
HIN2  (via drill 0.25)
  Top 0.254: U$14.12 108.58,64.14 110.49,66.04 110.49,68.45 HIN2.1 | IC3.8 v43.18,52.07 | v88.9,54.61 v88.9,60.96
  Bottom 0.254: HIN2.1 111.51,69.98 HIN2.2 108.97,69.72 HIN2.3 106.43,69.98 HIN2.4 95.12,60.96 v88.9,60.96 | v43.18,52.07 44.45,52.07 46.99,54.61 v88.9,54.61
HIN3  (via drill 0.25)
  Top 0.254: U$17.12 121.28,64.14 123.19,66.04 123.19,68.45 HIN3.1 | IC3.11 v46.99,52.07 | v113.03,53.34 v114.3,60.96
  Bottom 0.254: HIN3.1 124.21,69.98 HIN3.2 121.67,69.72 HIN3.3 119.13,69.98 HIN3.4 114.3,67.44 v114.3,60.96 | v46.99,52.07 61.59,52.07 61.59,53.34 v113.03,53.34
HV_ADJ
  Top 0.254: R21.2 36.04,38.71 HV_ADJ.1 | U$1.D1 69.85,67.94 57.15,67.94 57.15,46.35 44.58,46.35 HV_ADJ.4
  Bottom 0.254: HV_ADJ.1 39.12,39.5 HV_ADJ.2 41.66,39.24 HV_ADJ.3 44.2,39.5 HV_ADJ.4
HV_SENSE  (via drill 0.25)
  Top 0.254: U$1.A5 HV_SENSE.4 | R23.1 R24.2 v67.94,29.21
  Bottom 0.254: HV_SENSE.1 67.06,20.45 HV_SENSE.2 69.6,20.19 HV_SENSE.3 72.14,20.45 HV_SENSE.4 | U$1.A5 67.94,27.3 v67.94,29.21
I_SENSE_0
  Top 0.254: R16.2 20.17,2.56 C10.1 | I_SENSE_0.4 46.23,14.61 20.32,14.61 18.41,12.7 18.41,6.99 19.68,5.71 R16.2 | 20.17,5.87 R16.2 | U$1.A2 62.23,20.32 59.82,20.32 I_SENSE_0.1
  Bottom 0.254: I_SENSE_0.4 54.36,20.45 I_SENSE_0.3 56.9,20.19 I_SENSE_0.2 59.44,20.45 I_SENSE_0.1
I_SENSE_1
  Top 0.254: C25.1 48.11,2.56 R41.2 46.99,5.71 46.35,6.35 46.35,11.43 49.53,14.61 61.59,14.61 64.77,17.78 I_SENSE_1.1 | U$1.A4 71.12,21.59 71.12,19.18 I_SENSE_1.3
  Bottom 0.254: I_SENSE_1.1 67.06,17.91 I_SENSE_1.2 69.6,17.65 I_SENSE_1.3 72.14,17.91 I_SENSE_1.4
ID0  (via drill 0.25)
  Top 0.254: R6.2 R5.1 v82.55,11.43 | IC4.10 30.48,12.06 31.11,12.7 40.13,12.7 ID0.1
  Bottom 0.254: ID0.1 42.04,8.51 ID0.2 41.78,5.97 ID0.3 | ID0.3 42.04,3.43 ID0.4 | v82.55,11.43 82.55,13.34 41.27,13.34 40.01,11.43 40.01,6.99 41.27,5.71 ID0.3
ID1  (via drill 0.25)
  Top 0.254: IC5.10 58.42,12.06 59.05,12.7 67.44,12.7 ID1.1 | R32.2 R31.1 v95.25,11.43
  Bottom 0.152: 74.3,6.99 74.3,11.43 73.66,12.06 69.85,12.06 69.85,10.29 ID1.1 69.98,7.87 | ID1.2 69.72,5.33
  Bottom 0.203: 83.19,6.99 74.3,6.99 | ID1.3 69.98,2.79
  Bottom 0.254: 69.98,7.87 ID1.2 | 69.72,5.33 ID1.3 | 69.98,2.79 ID1.4 | v95.25,11.43 95.25,9.53 83.19,9.53 83.19,6.99
ID2
  Top 0.254: R48.1 R49.2
ID3
  Top 0.254: R57.1 R58.2 | R58.2 124.94,11.28 125.09,11.43 124.61,11.43 R58.2
LIN0  (via drill 0.25)
  Top 0.254: IC2.1 v66.04,66.04 | U$4.14 80.64,65.41 80.01,66.04 80.01,73.03 81.28,74.3 87.63,74.3 88.27,73.66 88.27,69.09 LIN0.1
  Bottom 0.254: LIN0.1 86.11,67.44 LIN0.2 83.57,67.18 LIN0.3 81.03,67.44 LIN0.4 77.34,66.04 v66.04,66.04
LIN1  (via drill 0.25)
  Top 0.254: IC2.4 v62.23,63.5 | U$11.14 93.34,65.41 92.71,66.04 92.71,73.03 93.98,74.3 100.33,74.3 100.97,73.66 100.97,69.09 LIN1.1
  Bottom 0.254: LIN1.1 98.81,67.44 LIN1.2 96.27,67.18 LIN1.3 93.73,67.44 LIN1.4 91.44,66.04 88.9,63.5 v62.23,63.5
LIN2  (via drill 0.25)
  Top 0.254: U$14.14 106.05,65.41 105.41,66.04 105.41,73.03 106.68,74.3 113.03,74.3 113.67,73.66 113.67,69.09 LIN2.1 | IC2.10 v60.96,55.88 | v101.6,55.88 v101.6,60.96
  Bottom 0.254: LIN2.1 111.51,67.44 LIN2.2 108.97,67.18 LIN2.3 106.43,67.44 LIN2.4 101.6,64.9 v101.6,60.96 | v60.96,55.88 v101.6,55.88
LIN3  (via drill 0.25)
  Top 0.254: U$17.14 118.75,65.41 118.11,66.04 118.11,73.03 119.38,74.3 125.73,74.3 126.36,73.66 126.36,69.09 LIN3.1 | IC2.13 v64.77,52.07
  Bottom 0.254: v64.77,52.07 119.38,52.07 124.46,57.15 124.46,62.1 LIN3.3 | LIN3.4 119.13,67.44 LIN3.3 | LIN3.3 121.67,67.18 LIN3.2 124.21,67.44 LIN3.1
N$1
  Top 0.254: R1.2 86.36,28.67 U$2.1
N$2
  Top 0.254: R2.2 78.59,43.03 77.47,41.91 77.47,33.66 79,32.12 U$3.1 78.97,30.73
N$3  (1 unrouted)
  Top 0.203: U$4.6 84.45,46.99 85.59,45.85 C1.2 83.95,45.85 83.82,45.72 83.82,40.64 81.28,38.1
  Top 0.254: U$3.3 81.28,27.94 | 81.28,27.94 82.53,27.94 U$2.2 | R3.1 80.8,27.46 81.28,27.94
N$4
  Top 0.254: R5.2 R4.1 C3.1 78.61,19.05 77.47,19.05 77.09,19.43 77.09,23.75 77.95,24.61 R3.2
N$5
  Top 0.254: U$4.7 85.72,48.51 87.38,46.86 87.38,43.05 | 87.38,43.05 87.38,41.04 D1.C | C1.1 87.12,43.05 87.38,43.05
N$6
  Top 0.254: R1.1 87.53,33.17 88.14,33.78 88.14,48.56 U$4.8
N$7
  Top 0.254: U$4.1 R2.1
N$8  (via drill 0.25)
  Top 0.254: IC1.2 v34.29,62.23 | v49.53,62.23 IC3.2 | IC2.3 v63.5,62.23
  Bottom 0.254: v34.29,62.23 v49.53,62.23 v63.5,62.23
N$9
  Top 0.254: IC4.9 IC4.8 35.35,10.86 R12.1
N$10
  Top 0.254: IC1.1 35.56,62.99 C5.1 36.06,66.02 R9.2
N$11
  Top 0.254: R10.2 R16.1 23.07,5.66 IC4.1
N$12
  Top 0.254: R17.2 48.26,31.75 U$5.2
N$13
  Top 0.254: IC4.2 26.67,7.14 R13.2 R10.1
N$14
  Top 0.254: IC4.3 27.94,7.11 28.32,7.49 38.23,7.49 | 38.23,7.49 38.23,5.74 R11.1 | R12.2 38.25,7.52 38.23,7.49
N$15
  Top 0.254: IC4.5 30.48,4.06 33.15,4.06 33.15,2.56 R15.2 R14.2
N$16
  Top 0.254: IC4.6 IC4.7 35.35,5.66 R11.2
N$17
  Top 0.254: U8.7 22.54,39.68 22.86,40.01 26.67,40.01 28.57,38.1 L1.1
N$18
  Top 0.254: U8.6 23.18,39.06 23.5,39.37 24.77,39.37 25.02,39.12 25.02,34.67 26.67,33.02 L1.2 34.8,33.02 C14.1 36.06,28.83 HV_IN.1 35.28,26.52 R19.1 | R17.1 41.76,28.22 HV_IN.3
  Bottom 0.254: HV_IN.1 39.12,28.07 HV_IN.2 41.66,27.81 HV_IN.3 44.2,28.07 HV_IN.4
N$19
  Top 0.254: C11.1 5.23,11.56 U$7.4
N$20
  Top 0.254: U8.5 23.84,36.87 24.51,36.45 24.51,32.51 27.3,29.46 28.47,29.46 R20.2 R19.2
N$21
  Top 0.254: L2.2 15.91,37.51 D2.A 13.96,33.37 U$6.1
N$22
  Top 0.254: R27.2 99.06,28.67 U$9.1
N$23
  Top 0.254: R26.1 2.56,29.08 C17.2 5.74,29.06 R25.2 11.56,29.06 U$6.3
N$24  (via drill 0.25)
  Top 0.254: R21.1 v40.26,35.56 R22.1
  Bottom 0.254: U$5.6 45.34,30.48 v40.26,35.56
N$25
  Top 0.254: R28.2 91.29,43.03 90.17,43.18 90.17,33.56 91.7,32.03 U$10.1
N$26
  Top 0.254: 96.52,45.72 96.52,40.64 93.98,39.37 U$10.3 93.98,27.94 | 96.52,45.72 97.79,45.72 97.16,48.26 U$11.6 | C20.2 96.65,45.85 96.52,45.72 | 93.98,27.94 93.34,27.3 91.59,27.3 R29.1 | U$9.2 95.23,27.94 93.98,27.94
N$27
  Top 0.254: U$11.8 100.84,48.56 100.84,34.95 R27.1
N$28
  Top 0.254: U$11.1 R28.1
N$29
  Top 0.254: D3.C 99.08,40.15 100.08,41.15 100.08,43.18 | 100.08,43.18 100.08,46.86 98.42,48.51 U$11.7 | C20.1 99.95,43.05 100.08,43.18
N$30
  Top 0.254: R29.2 90.91,24.61 89.79,23.5 89.79,19.43 90.17,19.05 91.31,19.05 C22.1 R30.1 R31.2
N$31
  Top 0.254: IC5.9 IC5.8 63.29,10.86 R37.1
N$32
  Top 0.254: IC5.2 54.61,7.14 R38.2 50.8,10.79 48.26,8.26 R35.1
N$33
  Top 0.254: R37.2 66.19,7.62 | 66.19,7.62 R36.1 | IC5.3 55.88,6.99 56.52,7.62 66.19,7.62
N$34
  Top 0.254: IC5.6 60.33,5.66 | 60.33,5.66 IC5.7 | R36.2 60.38,5.71 60.33,5.66
N$35
  Top 0.254: R35.2 R41.1 53.28,5.71 IC5.1
N$36
  Top 0.254: IC5.5 58.42,3.94 61.11,3.94 R40.2 R39.2
N$37
  Top 0.254: U$7.3 10.48,10.47 10.79,10.16 10.79,8.89 | U$7.1 10.48,8.57 | 10.48,8.57 10.79,8.89 | 10.48,8.57 10.48,6.16 C13.1 | 10.79,8.89 12.55,8.89 R42.2
N$38  (via drill 0.25)
  Top 0.254: IC1.6 v29.21,58.42 | v45.72,58.42 IC3.5 | IC2.6 v59.69,58.42
  Bottom 0.254: v29.21,58.42 v45.72,58.42 v59.69,58.42
N$39
  Top 0.254: IC1.5 30.48,63.37 C26.1 30.61,66.02 R43.2
N$40
  Top 0.254: R44.2 111.76,28.67 U$12.1
N$41
  Top 0.254: R45.2 102.23,43.66 102.23,33.66 104.4,32.12 U$13.1
N$42
  Top 0.254: U$14.6 109.86,48.26 110.49,45.72 109.22,45.72 | 109.22,45.72 109.22,40.6 U$13.3 106.68,27.94 | C27.2 109.35,45.85 109.22,45.72 | 106.68,27.94 106.2,27.46 R46.1 | U$12.2 107.93,27.94 106.68,27.94
N$43
  Top 0.254: R44.1 111.78,33.17 113.54,34.92 113.54,48.56 U$14.8
N$44
  Top 0.254: U$14.1 R45.1
N$45
  Top 0.254: U$14.7 111.12,48.51 112.78,46.86 112.78,43.18 | 112.78,43.18 112.78,41.17 D4.C | C27.1 112.65,43.05 112.78,43.18
N$46
  Top 0.254: R46.2 103.48,24.61 102.49,23.62 102.49,19.43 102.87,19.05 104.01,19.05 C29.1 R47.1 R48.2
N$47  (via drill 0.25)
  Top 0.254: IC1.8 v27.94,55.88 | v45.72,55.88 IC3.10 | IC2.9 v59.69,55.88
  Bottom 0.254: v27.94,55.88 v45.72,55.88 v59.69,55.88
N$48
  Top 0.254: R53.2 124.46,28.67 U$15.1
N$49
  Top 0.254: IC1.9 29.21,50.93 C31.1 29.34,47.65 R52.2
N$50
  Top 0.254: R54.2 116.69,43.03 114.94,43.18 114.94,33.66 117.1,32.12 U$16.1
N$51
  Top 0.254: U$17.6 122.56,48.26 123.19,46.35 123.69,45.85 | C32.2 123.69,45.85 | 123.69,45.85 123.83,45.72 121.92,45.72 121.92,40.64 U$16.3 119.38,27.94 | 119.38,27.94 118.75,27.3 116.99,27.3 R55.1 | U$15.2 120.63,27.94 119.38,27.94
N$52
  Top 0.254: U$17.8 125.09,48.26 126.36,46.99 126.36,35.08 R53.1
N$53
  Top 0.254: U$17.1 R54.1
N$54
  Top 0.254: U$17.7 123.83,48.39 125.48,46.74 125.48,43.18 | 125.48,43.18 125.48,41.17 D5.C | C32.1 125.35,43.05 125.48,43.18
N$55
  Top 0.254: R55.2 116.05,24.61 114.94,23.5 114.94,19.68 115.57,19.05 116.71,19.05 C34.1 R56.1 R57.2 | R57.2 120.8,14.12 121.28,14.61 121.13,14.61 R57.2
N$56  (via drill 0.25)
  Top 0.254: IC1.12 33.02,52.07 31.75,50.8 v31.75,49.53 | v49.53,49.53 IC3.13 | IC2.12 v63.5,49.53
  Bottom 0.254: v31.75,49.53 v49.53,49.53 v63.5,49.53
N$57
  Top 0.254: IC1.13 34.16,53.95 C36.1 34.14,50.78 R61.2
N$58  (via drill 0.25)
  Top 0.254: IC2.5 v60.96,63.5 | v46.99,63.5 IC3.4 | R43.1 27.79,67.16 29.21,68.58 31.75,68.58 33.02,67.31 v33.02,63.5 31.75,62.23 IC1.4
  Bottom 0.254: v60.96,63.5 v46.99,63.5 v33.02,63.5
N$59  (via drill 0.25)
  Top 0.254: IC2.2 v64.77,66.04 | v50.8,66.04 IC3.1 | v40.64,66.04 40.01,66.67 R9.1 | IC1.10 30.48,55.88 29.21,57.15 25.4,57.15 24.77,57.78 v24.77,66.04
  Bottom 0.254: v64.77,66.04 v50.8,66.04 v40.64,66.04 v24.77,66.04
N$60  (via drill 0.35)
  other vias: 125.09,2.54
N$61  (via drill 0.35)
  other vias: 116.2,2.54
N$62  (via drill 0.35)
  other vias: 111.76,2.54
N$63  (via drill 0.35)
  other vias: 99.06,2.54
N$64  (via drill 0.35)
  other vias: 90.17,2.54
PWM_0  (via drill 0.25)
  Top 0.254: U$1.D7 52.7,73.03 15.88,73.03 12.7,69.85 PWM_0.2 | IC1.11 v31.75,57.15 | v22.86,57.15 v22.86,66.04
  Bottom 0.254: PWM_0.1 12.45,66.17 PWM_0.2 14.99,65.91 PWM_0.3 17.53,66.17 PWM_0.4 22.73,65.91 v22.86,66.04 | v31.75,57.15 v22.86,57.15
PWM_1  (via drill 0.25)
  Top 0.254: U$1.D6 57.15,72.39 55.88,73.66 15.24,73.66 8.89,67.31 8.89,64.9 PWM_1.1 | IC1.3 v33.02,62.23
  Bottom 0.254: PWM_1.1 12.45,63.63 PWM_1.2 14.99,63.37 PWM_1.3 17.53,63.63 PWM_1.4 18.92,62.23 v33.02,62.23
PWM_2  (via drill 0.25)
  Top 0.254: U$1.D5 56.52,74.3 14.61,74.3 7.62,67.31 7.62,53.47 PWM_2.1 | v24.13,50.8 24.13,48.26 24.77,47.62 R52.1 | IC3.9 v44.45,50.8 | IC2.8 v58.42,50.8
  Bottom 0.254: PWM_2.1 12.45,50.93 PWM_2.2 14.99,50.67 PWM_2.3 17.53,50.93 PWM_2.4 17.91,50.8 v24.13,50.8 v44.45,50.8 v58.42,50.8
PWM_3  (via drill 0.25)
  Top 0.254: U$1.D3 64.77,72.39 62.23,74.93 13.97,74.93 6.35,67.31 6.35,51.44 9.53,48.26 10.03,48.26 PWM_3.1 | IC2.11 v62.23,48.26 | v39.37,48.26 38.73,47.62 R61.1 | IC3.12 v48.26,48.26
  Bottom 0.254: PWM_3.1 12.45,48.39 PWM_3.2 14.99,48.13 PWM_3.3 17.53,48.39 PWM_3.4 39.24,48.13 v39.37,48.26 46.99,48.26 v48.26,48.26 v62.23,48.26
SD_0
  Top 0.254: U$4.13 81.92,65.41 82.55,66.04 82.55,71.25 SD_0.2
  Bottom 0.254: SD_0.1 86.11,72.52 SD_0.2 83.57,72.26 SD_0.3 81.03,72.52 SD_0.4 78.23,72.52 74.3,68.58 50.55,68.58 U$1.D9
SD_1
  Top 0.254: U$11.13 94.61,65.41 95.25,66.04 95.25,71.25 SD_1.2
  Bottom 0.254: SD_1.1 98.81,72.52 SD_1.2 96.27,72.26 SD_1.3 93.73,72.52 SD_1.4 89.41,72.52 87.63,74.3 78.11,74.3 73.03,69.22 64.14,69.22 U$1.D4
SD_2
  Top 0.254: U$14.13 107.31,65.41 107.95,66.04 107.95,71.25 SD_2.2
  Bottom 0.254: SD_2.1 111.51,72.52 SD_2.2 108.97,72.26 SD_2.3 106.43,72.52 SD_2.4 104.01,72.52 101.6,74.93 78.11,74.93 73.03,69.85 68.58,69.85 U$1.D2
SD_3
  Top 0.254: U$17.13 120.02,65.41 120.65,66.04 120.65,71.25 SD_3.2
  Bottom 0.254: SD_3.1 124.21,72.52 SD_3.2 121.67,72.26 SD_3.3 119.13,72.52 SD_3.4 113.79,75.56 76.83,75.56 U$1.D0
V+  (via drill 0.25)
  Top 0.254: U$5.3 C16.1 72.51,38.11 HV_OUT.1 | U$2.3 85.13,20.36 v85.09,20.32 | U$9.3 97.75,20.36 v97.79,20.32 | R24.1 HV_OUT.4 | U$12.3 v110.49,20.32 | v123.19,20.32 U$15.3
  Bottom 0.254: HV_OUT.1 73.79,34.54 HV_OUT.2 73.53,32 HV_OUT.3 73.79,29.46 HV_OUT.4 76.24,29.21 v85.09,20.32 v97.79,20.32 v110.49,20.32 v123.19,20.32
V_SENSE_0
  Top 0.254: IC4.13 IC4.14 25.4,12.06 24.77,12.7 | R13.1 22.07,12.7 24.77,12.7 | V_SENSE_0.4 48.13,13.97 26.04,13.97 24.77,12.7 | U$1.A1 60.96,21.59 58.42,21.59 58.42,19.18 V_SENSE_0.2
  Bottom 0.254: V_SENSE_0.4 54.36,17.91 V_SENSE_0.3 56.9,17.65 V_SENSE_0.2 59.44,17.91 V_SENSE_0.1
V_SENSE_1
  Top 0.254: R38.1 48.11,11.91 48.9,12.7 52.7,12.7 | 52.7,12.7 53.34,12.06 IC5.14 IC5.13 | V_SENSE_1.1 63.63,15.37 62.23,13.97 53.98,13.97 52.7,12.7 | U$1.A3 68.58,21.59 68.58,16.64 V_SENSE_1.3
  Bottom 0.254: V_SENSE_1.1 67.06,15.37 V_SENSE_1.2 69.6,15.11 V_SENSE_1.3 72.14,15.37 V_SENSE_1.4
VCC
  Top 0.254: U8.2 U8.3 23.18,29.66 C15.1 22.73,29.21 20.32,29.21 | 26.67,24.13 VCC.4 25.4,20.83 25.4,15.75 17.78,15.75 13.49,11.58 R42.1 | 26.67,24.13 53.34,24.13 U$1.VIN | J1.PWR 14.64,22.35 VCC.1 | 26.67,24.13 20.32,24.13 20.32,29.21 | 20.32,29.21 17.91,29.21 C19.1 17.78,31.62 | 17.78,31.62 L2.1 | 17.78,31.62 17.59,31.43 U$6.5 U$6.4
  Bottom 0.254: VCC.1 21.34,22.35 VCC.2 23.88,22.1 VCC.3 26.42,22.35 VCC.4
VD0  (via drill 0.25)
  Top 0.254: R8.2 R7.1 v81.92,7.62 | IC4.12 27.94,12.7 28.57,13.34 41.91,13.34 44.45,10.79 VD0.1
  Bottom 0.203: v81.92,7.62 81.28,12.7 73.66,12.7
  Bottom 0.254: VD0.1 44.58,8.51 VD0.2 44.32,5.97 VD0.3 | VD0.3 44.58,3.43 VD0.4 | 74.3,12.7 73.66,12.7 50.29,12.7 VD0.3
VD1  (via drill 0.25)
  Top 0.254: IC5.12 55.88,12.7 56.52,13.34 69.34,13.34 VD1.1 | R34.2 R33.1 v94.61,7.62
  Bottom 0.203: v94.61,7.62 94.61,6.35 85.09,6.35 | 84.45,6.35 72.26,6.35
  Bottom 0.254: VD1.1 72.52,7.87 VD1.2 72.26,6.35 72.26,5.33 VD1.3 72.52,2.79 VD1.4 | 85.09,6.35 84.45,6.35
VD2
  Top 0.254: R50.1 R51.2
VD3
  Top 0.254: R60.2 R59.1
VDD
  Top 0.254: IC4.4 29.21,2.54 | 29.21,2.54 R15.1 | IC5.4 57.15,2.54 | 57.15,2.54 C24.1 55.88,2.41 55.88,0.64 27.94,0.64 | 57.15,2.54 R40.1 | U$7.5 5.91,8.57 C12.1 3.04,2.8 VDDA.1 | VDDA.4 17.27,2.41 19.05,0.64 27.94,0.64 | 29.21,2.54 C6.1 28.07,0.77 27.94,0.64
  Bottom 0.254: VDDA.1 5.46,2.67 VDDA.2 8,2.41 VDDA.3 | VDDA.3 10.54,2.67 VDDA.4 | U$1.AREF 2.54,71.12 2.54,8.38 VDDA.3
VO0
  Top 0.152: 80.01,5.56 X1.1
  Top 0.254: R4.2 78.74,7.77 R7.2 80.01,5.56
VO1
  Top 0.203: R33.2 92.73,5.7 93.34,5.08 94.61,4.45
  Top 0.254: R30.2 91.44,8.1 R33.2 | 94.61,4.45 X2.1 94.61,1.27
VO2
  Top 0.152: 106.68,5.08 107.06,3.56 108.33,3.17 108.17,2.56 X3.1
  Top 0.254: R47.2 104.14,8.1 R50.2 105.26,6.5 106.68,5.08 107.31,2.54
VO3
  Top 0.152: 119.38,5.08 X4.1
  Top 0.203: 116.84,7.62 119.38,5.08
  Top 0.254: R56.2 116.84,8.1 R59.2 116.84,7.62

### Text on the board
tPlace: 2.2uH | 3.3-9V 1.5W | GND | CH0 | CH1 | CH2 | CH3 | GND